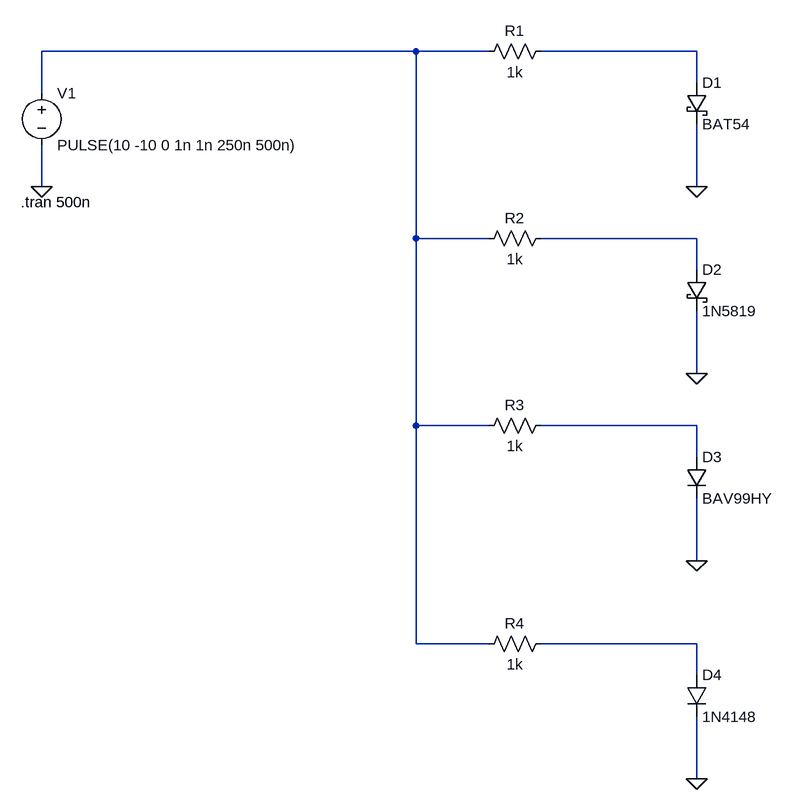
[diagram p0: schematic diode_reverse_recovery.asc]
diode_reverse_recovery.asc, the LTspice schematic file:
Version 4
SHEET 1 1144 1220
WIRE 592 80 16 80
WIRE 704 80 592 80
WIRE 1024 80 784 80
WIRE 1024 128 1024 80
WIRE 16 144 16 80
WIRE 16 288 16 224
WIRE 1024 288 1024 192
WIRE 592 368 592 80
WIRE 704 368 592 368
WIRE 1024 368 784 368
WIRE 1024 416 1024 368
WIRE 1024 576 1024 480
WIRE 592 656 592 368
WIRE 704 656 592 656
WIRE 1024 656 784 656
WIRE 1024 704 1024 656
WIRE 1024 864 1024 768
WIRE 592 992 592 656
WIRE 704 992 592 992
WIRE 1024 992 784 992
WIRE 1024 1040 1024 992
WIRE 1024 1200 1024 1104
FLAG 16 288 0
FLAG 1024 288 0
FLAG 1024 576 0
FLAG 1024 864 0
FLAG 1024 1200 0
SYMBOL voltage 16 128 R0
WINDOW 123 0 0 Left 0
WINDOW 39 0 0 Left 0
SYMATTR InstName V1
SYMATTR Value PULSE(10 -10 0 1n 1n 250n 500n)
SYMBOL res 800 64 R90
WINDOW 0 0 56 VBottom 2
WINDOW 3 32 56 VTop 2
SYMATTR InstName R1
SYMATTR Value 1k
SYMBOL schottky 1008 128 R0
SYMATTR InstName D1
SYMATTR Value BAT54
SYMATTR Description Diode
SYMATTR Type diode
SYMBOL res 800 352 R90
WINDOW 0 0 56 VBottom 2
WINDOW 3 32 56 VTop 2
SYMATTR InstName R2
SYMATTR Value 1k
SYMBOL schottky 1008 416 R0
SYMATTR InstName D2
SYMATTR Value 1N5819
SYMATTR Description Diode
SYMATTR Type diode
SYMBOL res 800 640 R90
WINDOW 0 0 56 VBottom 2
WINDOW 3 32 56 VTop 2
SYMATTR InstName R3
SYMATTR Value 1k
SYMBOL diode 1008 704 R0
SYMATTR InstName D3
SYMATTR Value BAV99HY
SYMBOL res 800 976 R90
WINDOW 0 0 56 VBottom 2
WINDOW 3 32 56 VTop 2
SYMATTR InstName R4
SYMATTR Value 1k
SYMBOL diode 1008 1040 R0
SYMATTR InstName D4
SYMATTR Value 1N4148
TEXT -16 312 Left 2 !.tran 500n

The netlist it stands for:
* diode_reverse_recovery.asc
V1 N001 0 PULSE(10 -10 0 1n 1n 250n 500n)
R1 N002 N001 1k
D1 N002 0 BAT54
R2 N003 N001 1k
D2 N003 0 1N5819
R3 N004 N001 1k
D3 N004 0 BAV99HY
R4 N005 N001 1k
D4 N005 0 1N4148
.model D D
.lib standard.dio
.tran 500n
.backanno
.end